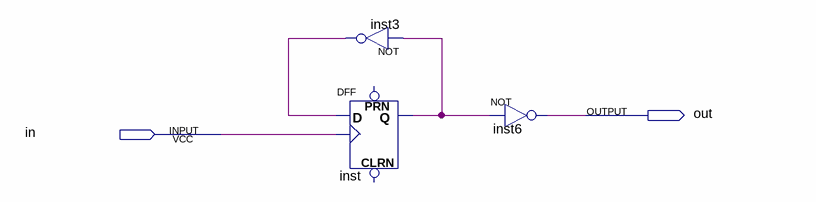
[diagram p0: schematic sheet]
// Quartus schematic divisor1.bdf as structural Verilog: 3 symbols, 2 pins
module divisor1 (
  input  in,
  output out
);

  wire inst3_out, inst_q;

  not inst3 (inst3_out, inst_q);
  DFF inst (.CLK(in), .D(inst3_out), .Q(inst_q));  // open: CLRN, PRN
  not inst6 (out, inst_q);
endmodule
